# Altium project Neopixel Breakout V0.PrjPcb
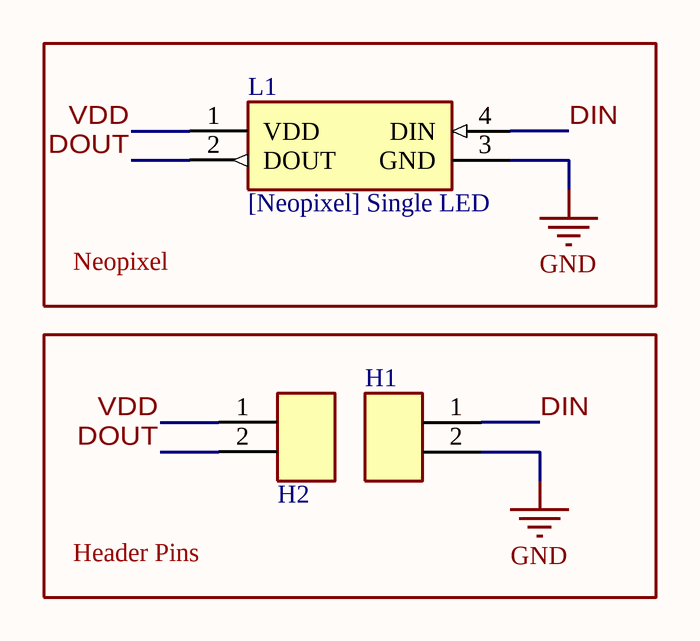
[diagram p0: Main.SchDoc]
1 sheet, 3 parts. Net scope: global (net labels, ports and power ports of the same name join across sheets).
Board file: Main.PcbDoc

## Sheet Main.SchDoc
size A; SheetNumber: 1; SheetTotal: 1

### Parts
H1  1x2 Header  [[Header] 1x2 Male]  (value not drawn)
H2  1x2 Header  [[Header] 1x2 Male]  (value not drawn)
L1  [Neopixel] Single LED  [[Neopixel] Single LED]

### Blocks framed on the sheet
Neopixel: L1
Header Pins: H1 H2

### Nets
GND: H1.2 L1.3(GND)
DIN: H1.1 L1.4(DIN)
DOUT: H2.2 L1.2(DOUT)
VDD: H2.1 L1.1(VDD)

### Library data of the parts
H1 H2 = [Header] 1x2 Male: 2.54mm pitch
L1 = [Neopixel] Single LED: WS2812B; Supplier 1: DigiKey; Supplier Part Number 1: 1568-16347CT-ND